# Altium schematic sheet MV-LED.SchDoc
size A4; DrawnBy: JvM; DocumentNumber: MV-LED Reproduction; Revision: A; SheetNumber: 1; SheetTotal: 1
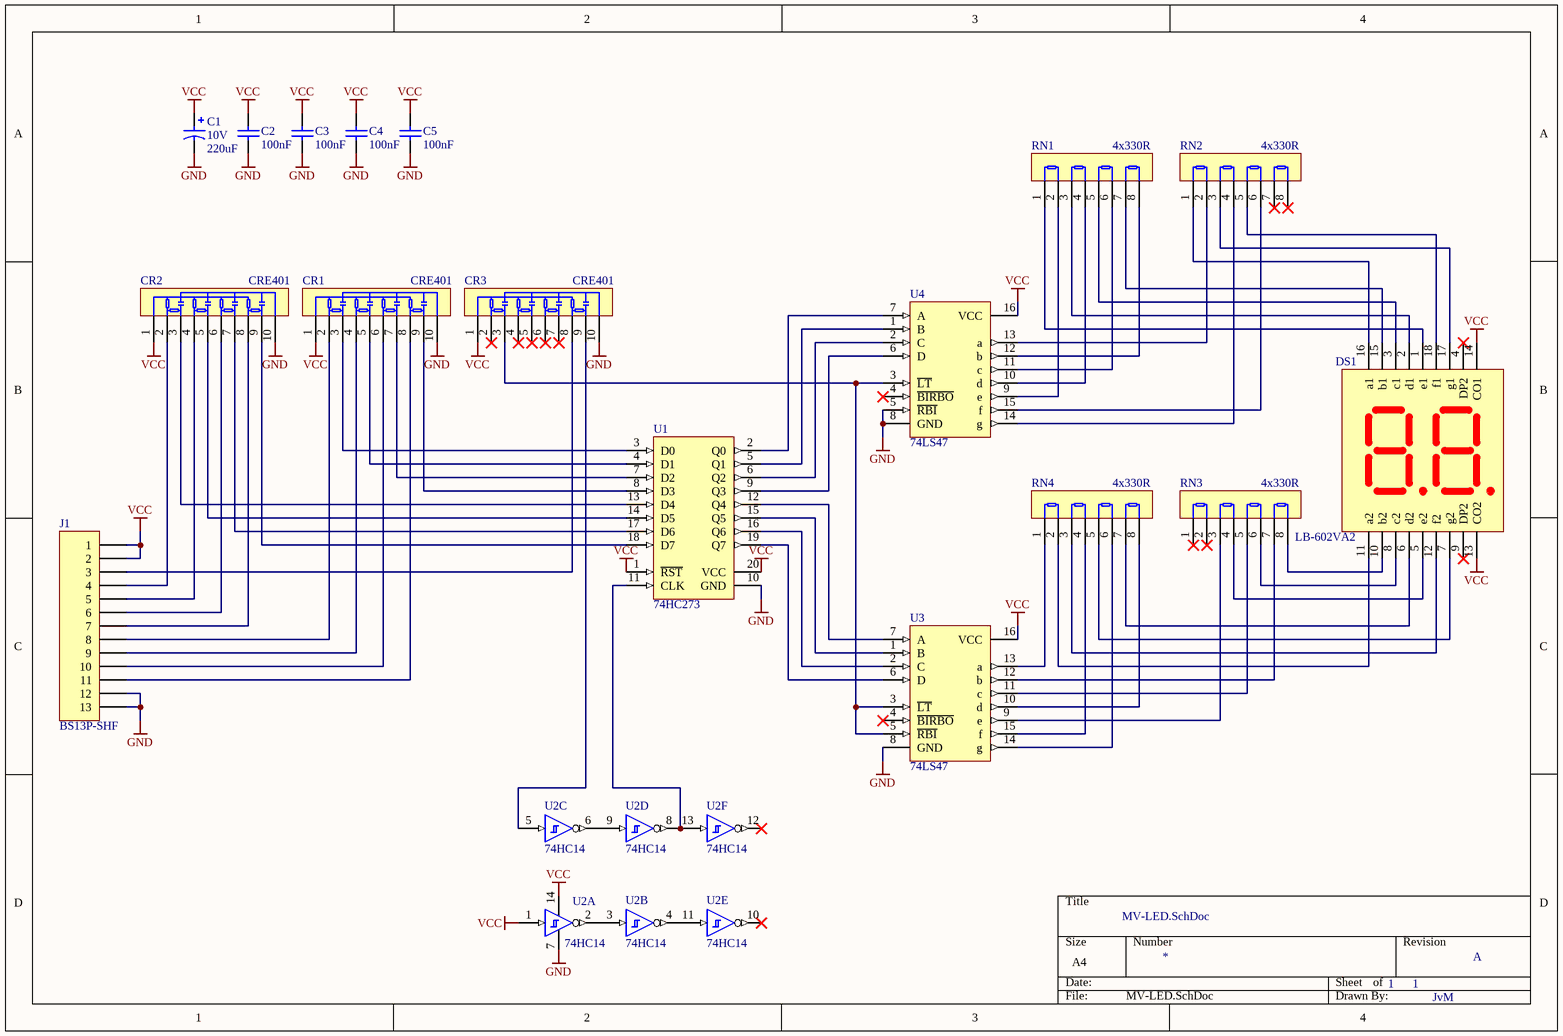
[diagram p0: MV-LED.SchDoc]

## Parts
C1  value 220uF  Voltage: 10V  [CapPol3.8_RA]  (hidden comment: CapPol3.8)
C2  value 100nF  [CapCer0.2]  (hidden comment: CapCer0.2)
C3  value 100nF  [CapCer0.2]  (hidden comment: CapCer0.2)
C4  value 100nF  [CapCer0.2]  (hidden comment: CapCer0.2)
C5  value 100nF  [CapCer0.2]  (hidden comment: CapCer0.2)
CR1  CRE401  [SIP10]
CR2  CRE401  [SIP10]
CR3  CRE401  [SIP10]
DS1  LB-602VA2  [LB-602VA2]
J1  BS13P-SHF  [JST BS13P-SHF-1AA]
RN1  4x330R  [SIP8]
RN2  4x330R  [SIP8]
RN3  4x330R  [SIP8]
RN4  4x330R  [SIP8]
U1  74HC273  [DIP20]
U2  74HC14  [DIP14]  (parts A,B,C,D,E,F of 6)
U3  74LS47  [DIP16]
U4  74LS47  [DIP16]

## Nets
GND: C1.2 C2.2 C3.2 C4.2 C5.2 CR1.10 CR2.10 CR3.10 J1.12 J1.13 U1.10(GND) U2.7(GND) U3.8(GND) U4.5(~{RBI}) U4.8(GND)
VCC: C1.1 C2.1 C3.1 C4.1 C5.1 CR1.1 CR2.1 CR3.1 DS1.13(CO2) DS1.14(CO1) J1.1 J1.2 U1.1(~{RST}) U1.20(VCC) U2.1(1A) U2.14(VCC) U3.16(VCC) U4.16(VCC)
NetCR1_2: CR1.2 J1.8
NetCR1_3: CR1.3 U1.3(D0)
NetCR1_4: CR1.4 J1.9
NetCR1_5: CR1.5 U1.4(D1)
NetCR1_6: CR1.6 J1.10
NetCR1_7: CR1.7 U1.7(D2)
NetCR1_8: CR1.8 J1.11
NetCR1_9: CR1.9 U1.8(D3)
NetCR2_2: CR2.2 J1.4
NetCR2_3: CR2.3 U1.13(D4)
NetCR2_4: CR2.4 J1.5
NetCR2_5: CR2.5 U1.14(D5)
NetCR2_6: CR2.6 J1.6
NetCR2_7: CR2.7 U1.17(D6)
NetCR2_8: CR2.8 J1.7
NetCR2_9: CR2.9 U1.18(D7)
NetCR3_3: CR3.3 U3.3(~{LT}) U3.5(~{RBI}) U4.3(~{LT})
NetCR3_8: CR3.8 J1.3
NetCR3_9: CR3.9 U2.5(3A)
NetDS1_1: DS1.1(e1) RN1.1
NetDS1_2: DS1.2(d1) RN1.3
NetDS1_3: DS1.3(c1) RN1.5
NetDS1_5: DS1.5(e2) RN3.4
NetDS1_6: DS1.6(d2) RN4.7
NetDS1_7: DS1.7(g2) RN4.5
NetDS1_8: DS1.8(c2) RN3.6
NetDS1_10: DS1.10(b2) RN3.8
NetDS1_11: DS1.11(a2) RN4.2
NetDS1_12: DS1.12(f2) RN4.3
NetDS1_15: DS1.15(b1) RN1.7
NetDS1_16: DS1.16(a1) RN2.1
NetDS1_17: DS1.17(g1) RN2.3
NetDS1_18: DS1.18(f1) RN2.5
NetRN1_2: RN1.2 U4.9(e)
NetRN1_4: RN1.4 U4.10(d)
NetRN1_6: RN1.6 U4.11(c)
NetRN1_8: RN1.8 U4.12(b)
NetRN2_2: RN2.2 U4.13(a)
NetRN2_4: RN2.4 U4.14(g)
NetRN2_6: RN2.6 U4.15(f)
NetRN3_3: RN3.3 U3.9(e)
NetRN3_5: RN3.5 U3.11(c)
NetRN3_7: RN3.7 U3.12(b)
NetRN4_1: RN4.1 U3.13(a)
NetRN4_4: RN4.4 U3.15(f)
NetRN4_6: RN4.6 U3.14(g)
NetRN4_8: RN4.8 U3.10(d)
NetU1_2: U1.2(Q0) U4.7(A)
NetU1_5: U1.5(Q1) U4.1(B)
NetU1_6: U1.6(Q2) U4.2(C)
NetU1_9: U1.9(Q3) U4.6(D)
NetU1_11: U1.11(CLK) U2.8(4Y) U2.13(6A)
NetU1_12: U1.12(Q4) U3.7(A)
NetU1_15: U1.15(Q5) U3.1(B)
NetU1_16: U1.16(Q6) U3.2(C)
NetU1_19: U1.19(Q7) U3.6(D)
NetU2_2: U2.2(1Y) U2.3(2A)
NetU2_4: U2.4(2Y) U2.11(5A)
NetU2_6: U2.6(3Y) U2.9(4A)

Not connected (* = marked no-connect by the designer): CR3 2* 4* 5* 6* 7*; DS1 4(DP2)* 9(DP2)*; RN2 7* 8*; RN3 1* 2*; U2 10(5Y)* 12(6Y)*; U3 4(~{BIRBO})*; U4 4(~{BIRBO})*

## Library data of the parts
C1 = CapPol3.8: Polarized Capacitor, 3.8mm Pitch, 8mm Width
C2-C5 = CapCer0.2: Capacitor (THT), Ceramic, 5,08mm Pitch; Voltage: 50V
CR1-CR3 = CRE401: RRC Array
DS1 = LB-602VA2: Double Digits LED Numeric Display
J1 = JST BS13P-SHF-1AA: JST HVQ Series, 2.5mm Pitch 13 Way 1 Row Right Angle PCB Header THT; Pitch: 2.54mm
RN1-RN4 = SIL8_4RES_330R: Parallel Resistor Network 4x330R
U1 = 74HC273: Octal D Type FLIP-FLOP with Clear,
U2 = 74HC14: Hex Schmitt-Trigger Inverters
U3 U4 = 74LS47: BCD-to-Seven-Segment Decoder/Driver